# Altium schematic sheet power.SchDoc: Power
size A4; CheckedBy: rrodrigu; Author: Satxo; CompanyName: Satxo; Revision: 0v1; SheetNumber: 2; SheetTotal: 8; ProjectName: Basestation
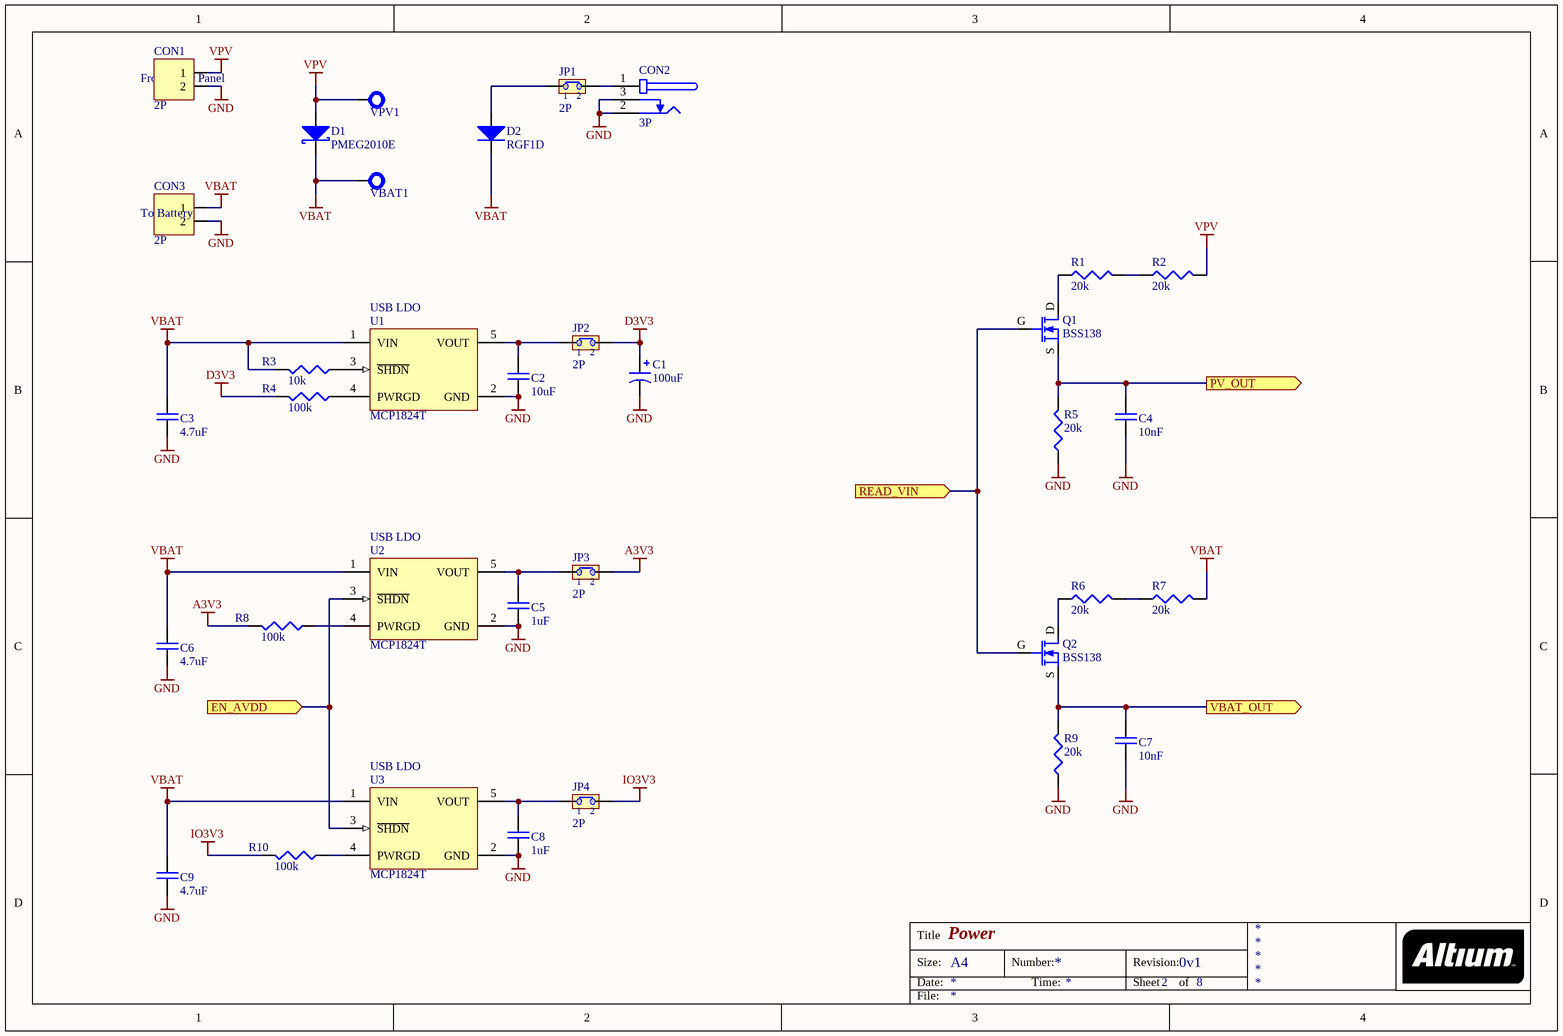
[diagram p0: power.SchDoc]

## Parts
C1  100uF  [RADIAL-2.5MM]
C2  10uF  [0805]
C3  4.7uF  [0805]
C4  10nF  [0603]
C5  1uF  [0805]
C6  4.7uF  [0805]
C7  10nF  [0603]
C8  1uF  [0805]
C9  4.7uF  [0805]
CON1  2P  [JST-2MM]
CON2  3P  [JACKPOW/PD-2.5MM-TH]
CON3  2P  [INTERLOCK2-5MM-FIXED]
D1  PMEG2010E  [SOD-123]
D2  RGF1D  [DO-214BA]
JP1  2P  [SIP-2]
JP2  2P  [SIP-2]
JP3  2P  [SIP-2]
JP4  2P  [SIP-2]
Q1  BSS138  [SOT-23@GSD]
Q2  BSS138  [SOT-23@GSD]
R1  20k  [0603]
R2  20k  [0603]
R3  10k  [0603]
R4  100k  [0603]
R5  20k  [0603]
R6  20k  [0603]
R7  20k  [0603]
R8  100k  [0603]
R9  20k  [0603]
R10  100k  [0603]
U1  MCP1824T  [SOT-23-5]
U2  MCP1824T  [SOT-23-5]
U3  MCP1824T  [SOT-23-5]
VBAT1  Test Point  [TERMINAL]  (value not drawn)  (no BOM)
VPV1  Test Point  [TERMINAL]  (value not drawn)  (no BOM)

## Ports
EN_AVDD (in), PV_OUT (out), READ_VIN (in), VBAT_OUT (out)

## Nets
A3V3: JP3.2 R8.2
D3V3: C1.1(P) JP2.2 R4.2
GND: C1.2(N) C2.1 C3.1 C4.1 C5.1 C6.1 C7.1 C8.1 C9.1 CON1.2 CON2.2 CON2.3 CON3.2 R5.1 R9.1 U1.2(GND) U2.2(GND) U3.2(GND)
IO3V3: JP4.2 R10.2
VBAT: C3.2 C6.2 C9.2 CON3.1 D1.K D2.K R3.2 R7.2 U1.1(VIN) U2.1(VIN) U3.1(VIN) VBAT1.1(TP)
VPV: CON1.1 D1.A R2.2 VPV1.1(TP)
EN_AVDD: U2.3(~{SHDN}) U3.3(~{SHDN}) ; port EN_AVDD
PV_OUT: C4.2 Q1.S R5.2 ; port PV_OUT
READ_VIN: Q1.G Q2.G ; port READ_VIN
VBAT_OUT: C7.2 Q2.S R9.2 ; port VBAT_OUT
NetC2_2: C2.2 JP2.1 U1.5(VOUT)
NetC5_2: C5.2 JP3.1 U2.5(VOUT)
NetC8_2: C8.2 JP4.1 U3.5(VOUT)
NetCON2_1: CON2.1 JP1.2
NetD2_A: D2.A JP1.1
NetQ1_D: Q1.D R1.1
NetQ2_D: Q2.D R6.1
NetR1_2: R1.2 R2.1
NetR3_1: R3.1 U1.3(~{SHDN})
NetR4_1: R4.1 U1.4(PWRGD)
NetR6_2: R6.2 R7.1
NetR8_1: R8.1 U2.4(PWRGD)
NetR10_1: R10.1 U3.4(PWRGD)

## Notes on the sheet
- From Solar Panel
- To Battery
- (near U1) USB LDO
- (near U2) USB LDO
- (near U3) USB LDO
- Title
- Size:
- Date:
- A4
- Number:
- Time:
- Revision:
- Sheet
- of
- File:

## Library data of the parts
C1 = CAP POL: Polarized Capacitor; Owner: Nuno Brum; Sub-Type: Tantalum; Assembly: INS; Validation date: 2006-05-15; Creation Date: 2005-04-28; Status: Valid; Type: Capacitor
C2-C9 = CAP: Capacitor; Owner: Nuno Brum; Sub-Type: Ceramic; Assembly: INS; Maximum Voltage: *; Creation Date: 2005-04-28; Status: Valid; Validation date: 2006-05-15; Type: Capacitor
CON1 CON3 = CON02: Connector 2 pins; Owner: Rui Rebelo; Assembly: INS; Sub-Type: Connector; Creation Date: 2005-05-27; Status: Valid; Validation Date: 2006-05-15; Type: Electrical & Mechanical
CON2 = JACK POWER PD: Jack Power with insertion detect; Sub-Type: Connector; Owner: Gonçalo Costa; Assembly: INS; Creation Date: 2005-12-05; Status: New; Type: Electrical & Mechanical
D1 = Diode Schottky: Small Signal Schottky Diode; Owner: Nuno Brum; Assembly: INS; Validation date: 2006-05-15; Creation Date: 2001-06-05; Sub-Type: Schottky; Status: Valid; Model: PMEG2010E; Type: Diode
D2 = Diode: Vishay Standard Avalanche Sinterglass Diode; Owner: Nuno Brum; Sub-Type: Generic; Assembly: INS; Validation date: 2006-05-15; Creation Date: 2001-06-05; Status: Valid; Model: RGF1D; Type: Diode
JP1-JP4 = JMP2: 2-pin Jumper; Owner: Nuno Brum; Sub-Type: Connector; STATE1: 1; Assembly: INS; Validation Date: 2006-05-15; Creation Date: 2002-07-17; Status: Valid; Type: Electrical & Mechanical
Q1 Q2 = MOSFET-N: N-Channel Logic Level Enhancement Mode Field Effect Transistor; pin to pad: 2>3 3>2; Owner: Nuno Brum; Sub-Type: MOSFET; Assembly: INS; Creation Date: 2001-06-05; Status: Valid; Model: BSS138; Type: Transistor
R1-R10 = RES: Resistor; Owner: Nuno Brum; Sub-Type: Generic; Assembly: INS; Validation date: 2006-05-15; Creation Date: 2002-07-17; Status: Valid; Power: *; Type: Resistor
U1-U3 = MCP1824T: 300 mA, Low Voltage, Low Quiescent Current LDO Regulator, 5-Pin SOT-23, Extended Temperature, Tape and Reel; Published: 29-Jan-2009; DatasheetVersion: revA, Aug-2007; PackageVersion: revBB, Aug-2009; PackageReference: SOT-23-OT5; Publisher: Altium Limited; PackageDescription: 5-Lead Plastic Small Outline Transistor (OT) [SOT-23]; Supplier 1: Digi-Key; Supplier Part Number 1: MCP1824T-3302E/OTTR-ND; Supplier 2: Digi-Key; Supplier Part Number 2: MCP1824T-3302E/OTCT-ND; Supplier 3: Digi-Key; Supplier Part Number 3: MCP1824T-3302E/OTDKR-ND; Supplier 4: Farnell; Supplier Part Number 4: 1578387; Code_IPC: SOT23-5; ComponentLink1Description: Datasheet; ComponentLink1URL: http://ww1.microchip.com/downloads/en/DeviceDoc/22070a.pdf; ComponentLink2Description: Packaging Specification; ComponentLink2URL: http://www.microchip.com/stellent/groups/techpub_sg/documents/packagingspec/en012702.pdf; ComponentLink3Description: Microchip.com Home; ComponentLink3URL: http://www.microchip.com/
VBAT1 VPV1 = TEST-PROBE: Test/Probe Point; Owner: Nuno Brum; Sub-Type: Mechanical; Assembly: PCB; Validation Date: 2006-05-15; Type: PCB; Creation Date: 2005-06-01; Status: Valid